# Altium schematic sheet P[08]_CPU_MISC.SchDoc
size A
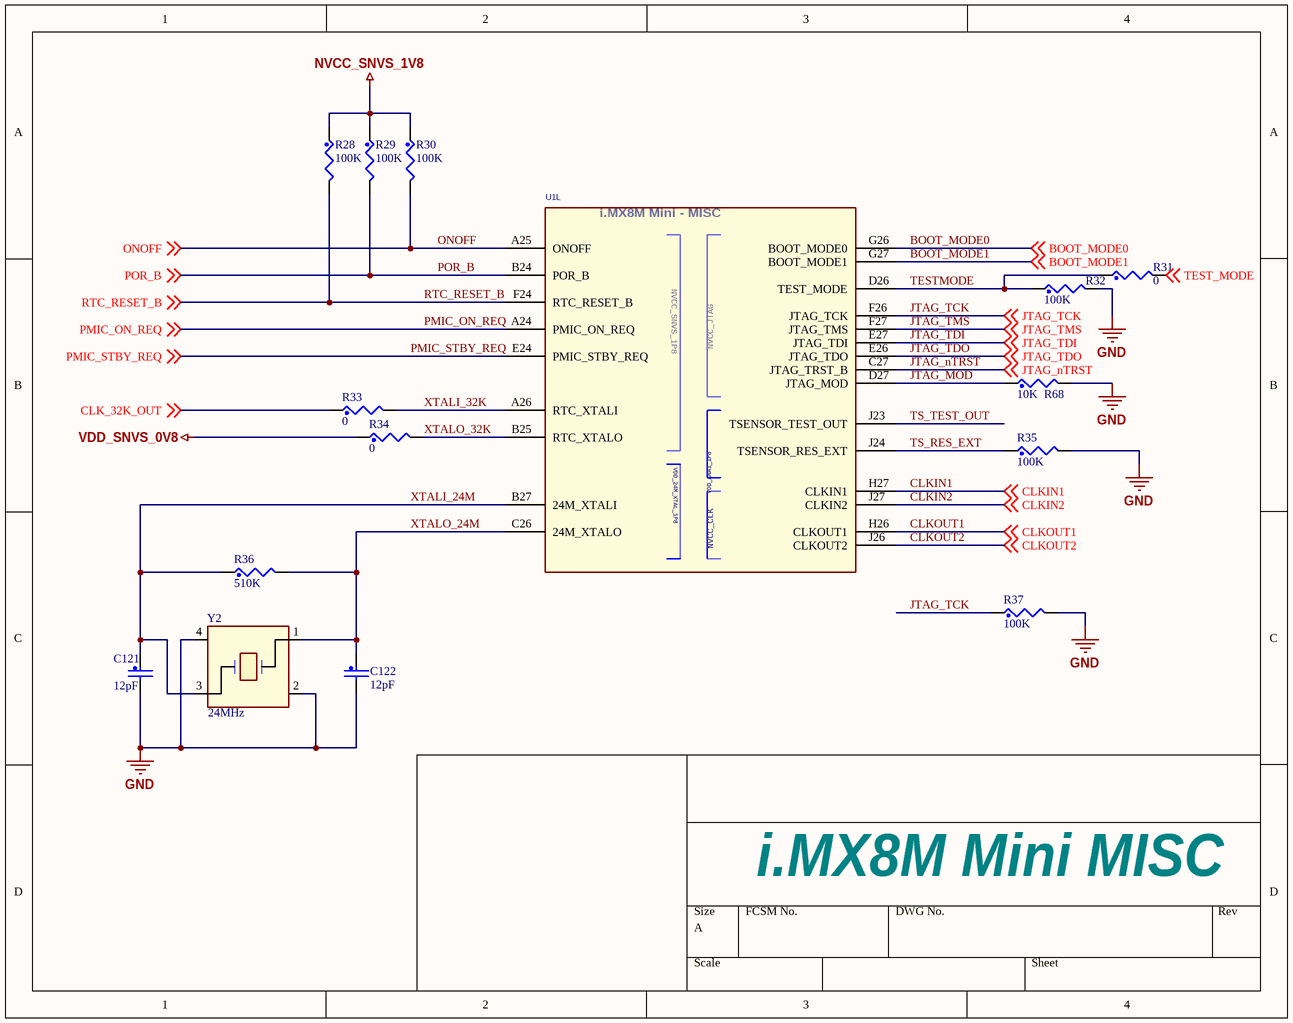
[diagram p0: P[08]_CPU_MISC.SchDoc]

## Parts
C121  12pF  [0201_CC - C]
C122  12pF  [0201_CC - C]
R28  100K  [0201_CC]
R29  100K  [0201_CC]
R30  100K  [0201_CC]
R31  0  [0402_CC]
R32  100K  [0201_CC]
R33  0  [0402_CC]
R34  0  [0402_CC]
R35  100K  [0201_CC]
R36  510K  [0402_CC]
R37  100K  [0201_CC]
R68  10K  [0201_CC]
U1  SFP_CGND  [BGA486_0P5_14X14]  (value not drawn)  (part L of 14)
Y2  24MHz  [OSCCC320X250X60]

## Nets
GND: C121.2 C122.2 R32.2 R35.2 R37.2 R68.2 Y2.2 Y2.4
NVCC_SNVS_1V8: R28.1 R29.1 R30.1
VDD_SNVS_0V8: R34.1
BOOT_MODE0: U1.G26(BOOT_MODE0) ; off-sheet BOOT_MODE0
BOOT_MODE1: U1.G27(BOOT_MODE1) ; off-sheet BOOT_MODE1
CLK_32K_OUT: R33.1 ; off-sheet CLK_32K_OUT
CLKIN1: U1.H27(CLKIN1) ; off-sheet CLKIN1
CLKIN2: U1.J27(CLKIN2) ; off-sheet CLKIN2
CLKOUT1: U1.H26(CLKOUT1) ; off-sheet CLKOUT1
CLKOUT2: U1.J26(CLKOUT2) ; off-sheet CLKOUT2
JTAG_MOD: R68.1 U1.D27(JTAG_MOD)
JTAG_nTRST: U1.C27(JTAG_TRST_B) ; off-sheet JTAG_nTRST
JTAG_TCK: R37.1 U1.F26(JTAG_TCK) ; off-sheet JTAG_TCK
JTAG_TDI: U1.E27(JTAG_TDI) ; off-sheet JTAG_TDI
JTAG_TDO: U1.E26(JTAG_TDO) ; off-sheet JTAG_TDO
JTAG_TMS: U1.F27(JTAG_TMS) ; off-sheet JTAG_TMS
ONOFF: R30.2 U1.A25(ONOFF) ; off-sheet ONOFF
PMIC_ON_REQ: U1.A24(PMIC_ON_REQ) ; off-sheet PMIC_ON_REQ
PMIC_STBY_REQ: U1.E24(PMIC_STBY_REQ) ; off-sheet PMIC_STBY_REQ
POR_B: R29.2 U1.B24(POR_B) ; off-sheet POR_B
RTC_RESET_B: R28.2 U1.F24(RTC_RESET_B) ; off-sheet RTC_RESET_B
TEST_MODE: R31.2 ; off-sheet TEST_MODE
TESTMODE: R31.1 R32.1 U1.D26(TEST_MODE)
TS_RES_EXT: R35.1 U1.J24(TSENSOR_RES_EXT)
TS_TEST_OUT: U1.J23(TSENSOR_TEST_OUT)
XTALI_24M: C121.1 R36.1 U1.B27(24M_XTALI) Y2.3
XTALI_32K: R33.2 U1.A26(RTC_XTALI)
XTALO_24M: C122.1 R36.2 U1.C26(24M_XTALO) Y2.1
XTALO_32K: R34.2 U1.B25(RTC_XTALO)

## Notes on the sheet
- i.MX8M Mini MISC
- (in symbol MIMX8MM_BGA486P, part L) i.MX8M Mini - MISC; VDD_ANA1_1P8

## Library data of the parts
C121 C122 = CAP_NP: CLASS: DISCRETE
R28-R37 R68 = RES: CLASS: DISCRETE
U1 = MIMX8MM_BGA486P: IC CPU QUAD CORTEX A53+M4 1.8GHZ BGA486 / By Arman Arvand; SPLIT_INST: TRUE; CAD_APPROVED: Yes; PRE_APN: 330-77072; MFG_PN01: MIMX8MM6DVTLZAA; MFG_NAME01: NXP SEMICONDUCTORS; AGILE_PN: TMP-WF-32905; CLASS: IC; HEIGHT: 1.25MM; ROHS: Yes
Y2 = XTAL_13Y: CLASS: IC